# EAGLE schematic schemat_1 (2) (EAGLE 6.5.0)
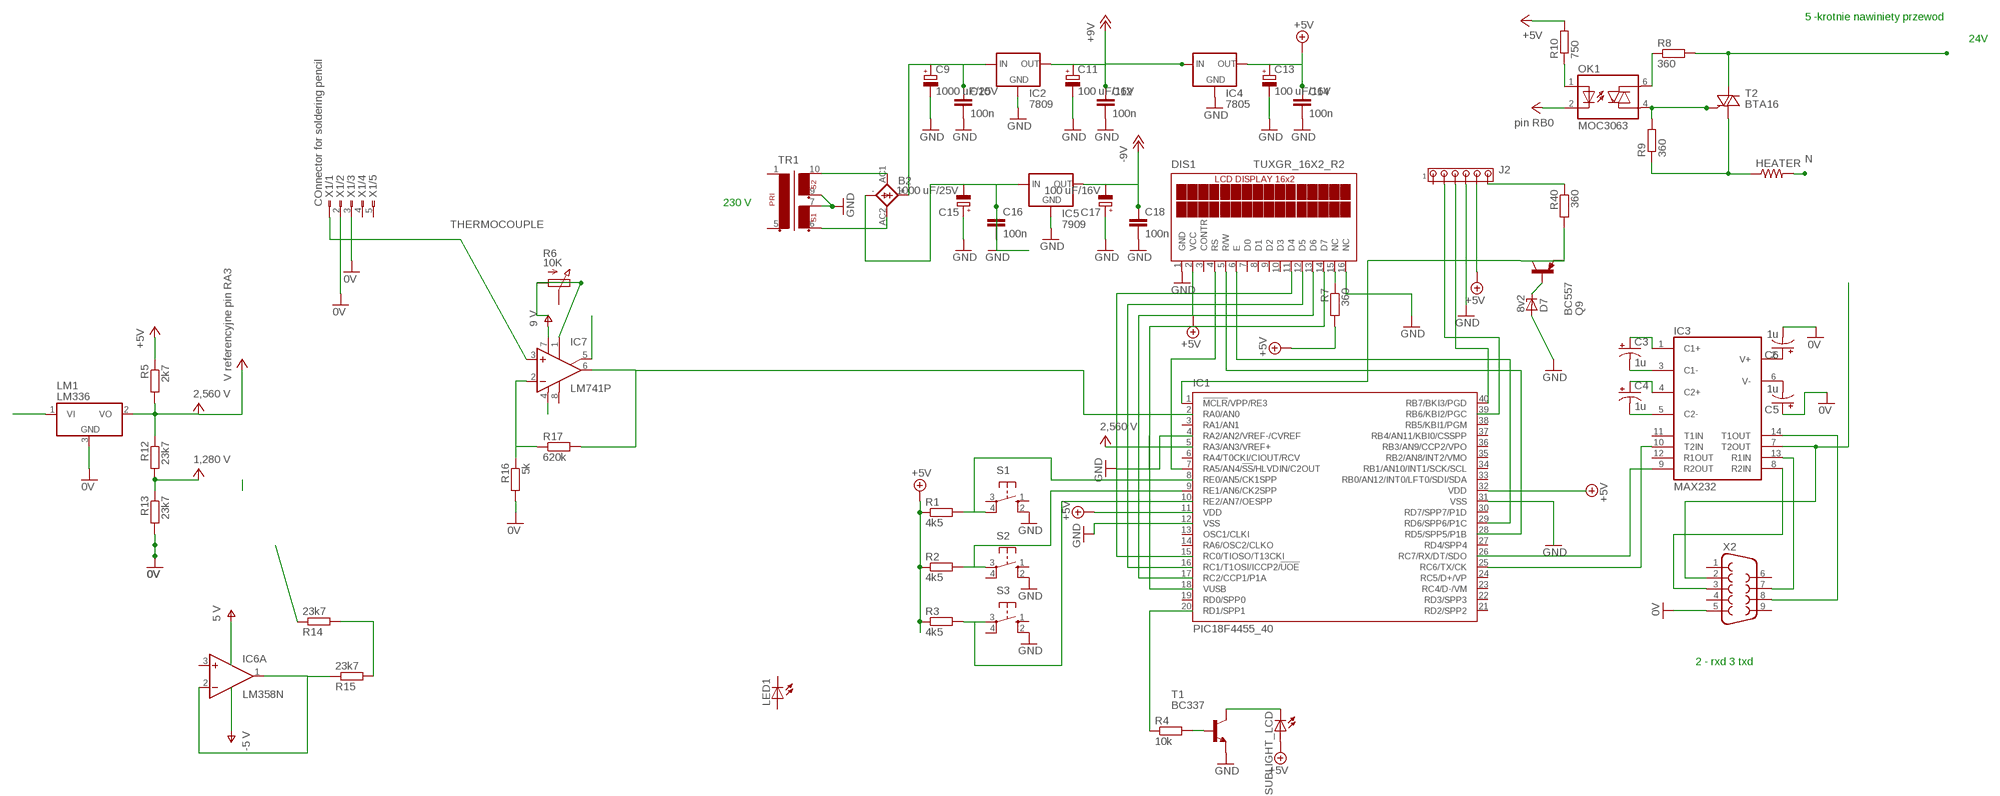
[diagram p0: schematic, sheet 1]

## Parts
B2  1KAB  [1KAB]
C3  1u  CPOL-US140CLH-1014  [140CLH-1014]
C4  1u  CPOL-US140CLH-1014  [140CLH-1014]
C5  1u  CPOL-US140CLH-1014  [140CLH-1014]
C6  1u  CPOL-US140CLH-1014  [140CLH-1014]
C9  1000 uF/25V  CPOL-EU140CLH-0810  [140CLH-0810@1]
C10  100n  C-EU025-030X050  [C025-030X050]
C11  100 uF/16V  CPOL-EU140CLH-0810  [140CLH-0810@1]
C12  100n  C-EU025-030X050  [C025-030X050]
C13  100 uF/16V  CPOL-EU140CLH-0810  [140CLH-0810@1]
C14  100n  C-EU025-030X050  [C025-030X050]
C15  1000 uF/25V  CPOL-EU140CLH-0810  [140CLH-0810@1]
C16  100n  C-EU025-030X050  [C025-030X050]
C17  100 uF/16V  CPOL-EU140CLH-0810  [140CLH-0810@1]
C18  100n  C-EU025-030X050  [C025-030X050]
D7  8v2  ZY  [P1Z12]
DIS1  TUXGR_16X2_R2  [TUXGR_16X2_R2]
HEATER  R-US_0204/2V  [0204V]
IC1  PIC18F4455_40  [DIL40]
IC2  7809  78XXS  [78XXS]
IC3  MAX232  [DIL16]
IC4  7805  78XXS  [78XXS]
IC5  7909  78XXS  [78XXS]
IC6  LM358N  [DIL08]
IC7  LM741P  [DIL08]
J2  MTA06-156  [1X6MTA]
LED1  LED5MM  [LED5MM]
LM1  LM336  [TO92]
OK1  MOC3063  MOC3023M  [DIL06]
Q9  BC557  [TO92]
R1  4k5  R-EU_0207/15  [0207/15]
R2  4k5  R-EU_0207/15  [0207/15]
R3  4k5  R-EU_0207/15  [0207/15]
R4  10k  R-EU_0207/15  [0207/15]
R5  2k7  R-EU_V234/12  [V234/12]
R6  10K  PC25  [PC25]
R7  360  R-EU_0207/15  [0207/15]
R8  360  R-EU_0204/7  [0204/7]
R9  360  R-EU_0204/7  [0204/7]
R10  750  R-EU_0204/7  [0204/7]
R12  23k7  R-EU_V234/12  [V234/12]
R13  23k7  R-EU_V234/12  [V234/12]
R14  23k7  R-EU_V234/12  [V234/12]
R15  23k7  R-EU_V234/12  [V234/12]
R16  5k  R-EU_V234/12  [V234/12]
R17  620k  R-EU_V234/12  [V234/12]
R40  360  R-EU_0207/15  [0207/15]
S1  10-XX  [B3F-10XX]
S2  10-XX  [B3F-10XX]
S3  10-XX  [B3F-10XX]
SUBLIGHT_LCD  LED5MM  [LED5MM]
T1  BC337  [TO92@1]
T2  BTA16  TIC253  [TO218DS]
TR1  EI38-2  [EI38-2]
X1  COnnector for soldering pencil  AS06-05  [AS06-05]
X2  F09D  [F09D]

## Nets
0V: C5.+ C6.- LM1.3(GND) R13.2 R16.2 X1.2 X1.3 X2.5
24V: R8.2 T2.A2
+3V3: OK1.2(C) ; supply symbol labelled pin RB0
+5V: C13.+ C14.1 DIS1.2(VCC) J2.5 LM1.2(VO) R1.1 R2.1 R3.1 R5.1 R5.2 R10.2 R12.1 SUBLIGHT_LCD.A ; supply symbol labelled 2,560 V, V referencyjne pin RA3
+12V: C11.+ C12.1 C18.1 IC2.OUT IC4.IN IC5.OUT ; supply symbol labelled +9V, -9V
GND: C9.- C10.2 C11.- C12.2 C13.- C14.2 C15.+ C16.2 C17.+ C18.2 D7.A DIS1.1(GND) DIS1.16(NC) IC2.GND IC4.GND IC5.GND J2.4 S1.2(S1) S2.2(S1) S3.2(S1) T1.1(E) TR1.7 TR1.9
N: HEATER.2
N$1: IC7.4(V-)
N$4: IC1.25(RC6/TX/CK) IC3.10(T2IN)
N$5: IC1.9(RE1/AN6/CK2SPP) R2.2 S2.3(P)
N$6: R3.2 S3.3(P)
N$7: DIS1.11(D4)
N$8: DIS1.4(RS) IC1.7(RA5/AN4/!SS!/HLVDIN/C2OUT)
N$9: IC3.13(R1IN) X2.7
N$10: IC3.9(R2OUT)
N$11: R1.2 S1.4(P1)
N$12: IC1.32(VDD)
N$13: IC1.31(VSS)
N$14: DIS1.6(E) IC1.29(RD6/SPP6/P1C)
N$15: IC7.5(ON2)
N$16: IC7.1(ON1) R6.A R6.E
N$17: DIS1.12(D5)
N$18: DIS1.5(R/W)
N$19: DIS1.13(D6)
N$20: IC1.40(RB7/BKI3/PGD) J2.3
N$21: DIS1.14(D7)
N$23: IC3.14(T1OUT)
N$24: DIS1.15(NC) R7.1
N$25: OK1.6(A2) R8.1
N$26: OK1.4(A1) R9.2 T2.G
N$27: X2.8
N$28: IC3.8(R2IN) X2.3
N$29: IC3.7(T2OUT) X2.2
N$30: OK1.1(A) R10.1
N$31: C4.- IC3.5(C2-)
N$32: C4.+ IC3.4(C2+)
N$33: C3.- IC3.3(C1-)
N$34: C3.+ IC3.1(C1+)
N$35: C5.- IC3.6(V-)
N$36: C6.+ IC3.2(V+)
N$37: J2.2
N$38: HEATER.1 R9.1 T2.A1
N$42: B2.AC1 TR1.10
N$43: B2.AC2 TR1.6
N$45: B2.- C15.- C16.1 IC5.IN
N$46: B2.+ C9.+ C10.1 IC2.IN
N$47: R4.2 T1.2(B)
N$48: R4.1
N$49: SUBLIGHT_LCD.K(C) T1.3(C)
N$50: LM1.1(VI)
N$51: R14.1
N$52: IC6.1(A:OUT) IC6.2(A:-IN) R15.1
N$53: R14.2 R15.2
N$54: IC7.2(-IN) R16.1 R17.1
N$59: IC7.6(OUT) R17.2
N$66: J2.6 R40.1
N$76: Q9.1(E) R40.2
N$77: D7.C Q9.2(B)
N$78: IC1.1(!MCLR!/VPP/RE3) Q9.3(C)
THERMOCOUPLE: IC7.3(+IN) X1.1
V+: IC7.7(V+) R12.2 R13.1 ; supply symbol labelled 5 V, -5 V, 9 V, 1,280 V, 2,560 V
Unconnected: C17.- DIS1.3(CONTR) DIS1.7(D0) DIS1.8(D1) DIS1.9(D2) DIS1.10(D3) IC1.2(RA0/AN0) IC1.3(RA1/AN1) IC1.4(RA2/AN2/VREF-/CVREF) IC1.5(RA3/AN3/VREF+) IC1.6(RA4/T0CKI/CIOUT/RCV) IC1.8(RE0/AN5/CK1SPP) IC1.10(RE2/AN7/OESPP) IC1.13(OSC1/CLKI) IC1.14(RA6/OSC2/CLKO) IC1.15(RC0/TIOSO/T13CKI) IC1.16(RC1/T1OSI/ICCP2/!UOE) IC1.17(RC2/CCP1/P1A) IC1.18(VUSB) IC1.19(RD0/SPP0) IC1.20(RD1/SPP1) IC1.21(RD2/SPP2) IC1.22(RD3/SPP3) IC1.23(RC4/D-/VM) IC1.24(RC5/D+/VP) IC1.26(RC7/RX/DT/SDO) IC1.27(RD4/SPP4) IC1.28(RD5/SPP5/P1B) IC1.30(RD7/SPP7/P1D) IC1.33(RB0/AN12/INT0/LFT0/SDI/SDA) IC1.34(RB1/AN10/INT1/SCK/SCL) IC1.35(RB2/AN8/INT2/VMO) IC1.36(RB3/AN9/CCP2/VPO) IC1.37(RB4/AN11/KBI0/CSSPP) IC1.38(RB5/KBI1/PGM) IC1.39(RB6/KBI2/PGC) IC3.11(T1IN) IC3.12(R1OUT) IC4.OUT IC6.3(A:+IN) IC6.5(B:+IN) IC6.6(B:-IN) IC6.7(B:OUT) IC7.8(OPT) J2.1 LED1.A LED1.K(C) R6.S R7.2 S1.1(S) S1.3(P) S2.1(S) S2.4(P1) S3.1(S) S3.4(P1) TR1.1 TR1.5 X1.4 X1.5 X2.1 X2.4 X2.6 X2.9

## Notes on the sheet
- 5 -krotnie nawiniety przewod
- 230 V
- 2 - rxd 3 txd

## Power pins joined to a net without a drawn wire
GND: IC3.15(GND)
V+: IC6.8(P:V+)
V-: IC6.4(P:V-)
VCC: IC3.16(VCC)
VDD: IC1.11(VDD)
VSS: IC1.12(VSS)

## Library data of the parts
B2 = rectifier:1KAB: RECTIFIER grid 5,08 x 5,08 mm
C3-C6 = rcl:CPOL-US: POLARIZED CAPACITOR, American symbol
C9 C11 C13 C15 C17 = rcl:CPOL-EU: POLARIZED CAPACITOR, European symbol
C10 C12 C14 C16 C18 = rcl:C-EU: CAPACITOR, European symbol
D7 = diode:ZY: Z DIODE
DIS1 = display-lcd:TUXGR_16X2_R2: Tuxgraphics LCD display 16x2 characters reflective, without background light Source: tuxgr_12x2_r2.pdf; OC_FARNELL: unknown; OC_NEWARK: unknown
HEATER = rcl:R-US_: RESISTOR, American symbol
IC1 = microchip:PIC18F4*_40: USB Microcontrollers with nanoWatt Technology High-Performance, Enhanced Flash, 28/40/44-Pin, Source: http://ww1.microchip.com/downloads/en/devicedoc/39632c.pdf; MF: MICROCHIP; MPN: PIC18F4455-I/P; OC_FARNELL: 9321314; OC_NEWARK: 05K2028
IC2 IC4 IC5 = v-reg:78XXS: VOLTAGE REGULATOR
IC3 = maxim:MAX232: RS232 TRANSEIVER
IC6 = linear:LM358: OP AMP also LM158; LM258; LM2904 Source: http://cache.national.com/ds/LM/LM158.pdf
IC7 = linear:*741: OP AMP
J2 = con-amp:MTA06-156: AMP connector; OC_FARNELL: unknown; OC_NEWARK: unknown
LED1 SUBLIGHT_LCD = led:LED: LED OSRAM: - CHIPLED LG R971, LG N971, LY N971, LG Q971, LY Q971, LO R971, LY R971 LH N974, LH R974 LS Q976, LO Q976, LY Q976 LO Q996 - Hyper CHIPLED LW Q18S LB Q993, LB Q99A, LB R99A - SideLED LS A670, LO A670, LY A670, LG A670, LP A670 LB A673, LV A673, LT A673, LW A673 LH A674 LY A675 LS A676, LA A676, LO A676, LY A676, LW A676 LS A679, LY A679, LG A679 - Hyper Micro SIDELED® LS Y876, LA Y876, LO Y876, LY Y876 LT Y87S - SmartLED LW L88C, LW L88S LB L89C, LB L89S, LG L890 LS L89K, LO L89K, LY L89K LS L896, LA L896, LO L896, LY L896 - TOPLED LS T670, LO T670, LY T670, LG T670, LP T670 LSG T670, LSP T670, LSY T670, LOP T670, LYG T670 LG T671, LOG T671, LSG T671 LB T673, LV T673, LT T673, LW T673 LH T674 LS T676, LA T676, LO T676, LY T676, LB T676, LH T676, LSB T676, LW T676 LB T67C, LV T67C, LT T67C, LS T67K, LO T67K, LY T67K, LW E67C LS E67B, LA E67B, LO E67B, LY E67B, LB E67C, LV E67C, LT E67C LW T67C LS T679, LY T679, LG T679 LS T770, LO T770, LY T770, LG T770, LP T770 LB T773, LV T773, LT T773, LW T773 LH T774 LS E675, LA E675, LY E675, LS T675 LS T776, LA T776, LO T776, LY T776, LB T776 LHGB T686 LT T68C, LB T68C - Hyper Mini TOPLED® LB M676 - Mini TOPLED Santana® LG M470 LS M47K, LO M47K, LY M47K Source: http://www.osram.convergy.de LUXEON: - LUMILED® LXK2-PW12-R00, LXK2-PW12-S00, LXK2-PW14-U00, LXK2-PW14-V00 LXK2-PM12-R00, LXK2-PM12-S00, LXK2-PM14-U00 LXK2-PE12-Q00, LXK2-PE12-R00, LXK2-PE12-S00, LXK2-PE14-T00, LXK2-PE14-U00 LXK2-PB12-K00, LXK2-PB12-L00, LXK2-PB12-M00, LXK2-PB14-N00, LXK2-PB14-P00, LXK2-PB14-Q00 LXK2-PR12-L00, LXK2-PR12-M00, LXK2-PR14-Q00, LXK2-PR14-R00 LXK2-PD12-Q00, LXK2-PD12-R00, LXK2-PD12-S00 LXK2-PH12-R00, LXK2-PH12-S00 LXK2-PL12-P00, LXK2-PL12-Q00, LXK2-PL12-R00 Source: www.luxeon.com KINGBRIGHT: KA-3528ASYC Source: www.kingbright.com
LM1 = statutowa:LM336: VOLTAGE REFERENCE
OK1 = optocoupler:MOC30*M: RANDOM-PHASE OPTOISOLATORS TRIAC DRIVER OUTPUT Source: http://www.fairchildsemi.com MOC3020-M.pdf
Q9 = transistor-pnp:BC557: PNP Transistor
R1-R5 R7-R10 R12-R17 R40 = rcl:R-EU_: RESISTOR, European symbol
R6 = pot-vitrohm:PC25: VITROHM POTENTIOMETER; MF: CLAROSTAT; MPN: 308NPC25KS; OC_FARNELL: 1440998; OC_NEWARK: 03F7518
S1-S3 = switch-omron:10-XX: OMRON SWITCH; MPN: B3F-1000; OC_FARNELL: 176432; OC_NEWARK: 36M3542
T1 = transistor:BC337: NPN TRANSISTOR
T2 = triac:TIC253: TRIAC
TR1 = trafo:EI38-2: TRANSFORMER 1 primary winding, 2 secondary windings ERA
X1 = con-deutsch:AS06-05: DEUTSCH Connector; OC_FARNELL: unknown; OC_NEWARK: unknown
X2 = con-subd:F09: SUB-D